# EAGLE design Eyebot_powerdist (EAGLE 6.4)
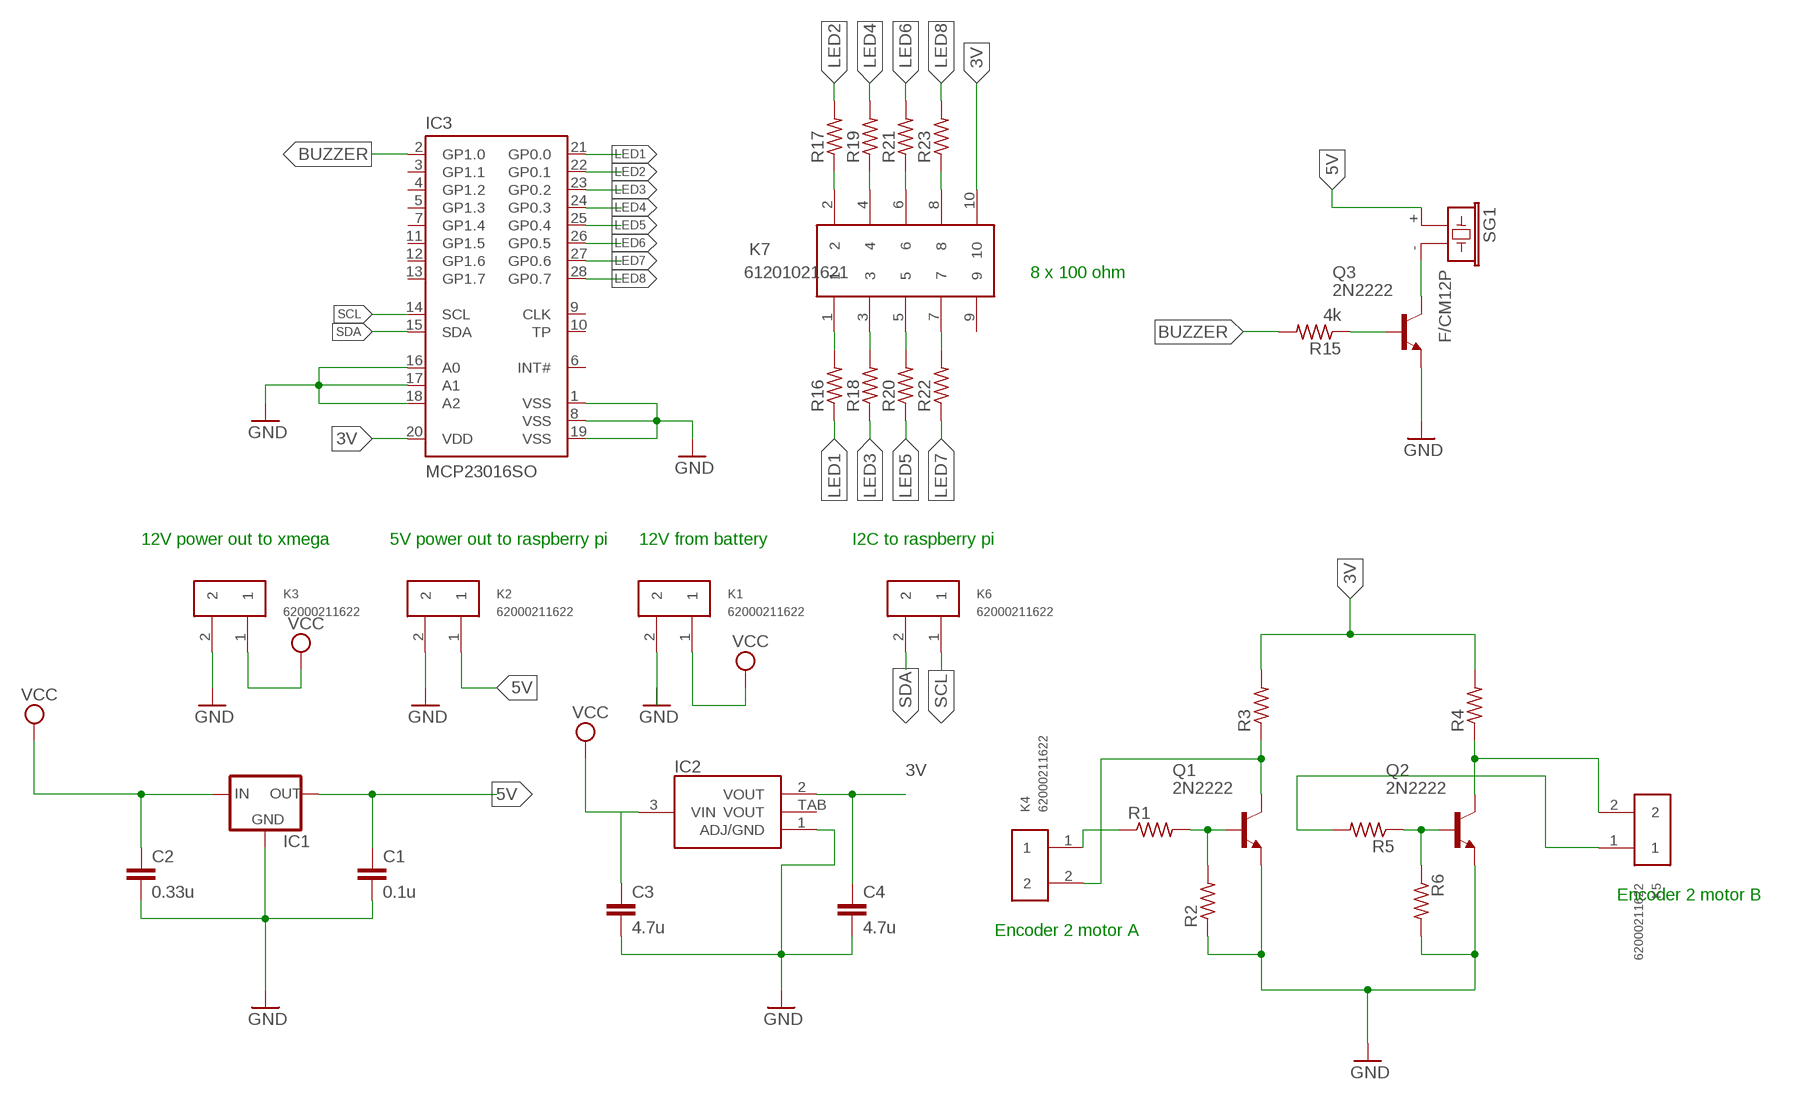
[diagram p0: schematic, sheet 1]

## Parts
C1  0.1u  CAP_  [AXIAL-5MM]
C2  0.33u  CAPPTH  [CAP-PTH-SMALL]
C3  4.7u  CAP1206  [1206]
C4  4.7u  CAP1206  [1206]
IC1  V_REG_78XX-TO-220  [TO-220-ALT]
IC2  LDO1117-SOT223  [SOT223-3L]
IC3  MCP23016SO  [SO-28W]
K1  62000211622  [62000211622]
K2  62000211622  [62000211622]
K3  62000211622  [62000211622]
K4  62000211622  [62000211622]
K5  62000211622  [62000211622]
K6  62000211622  [62000211622]
K7  61201021621  [61201021621]
Q1  2N2222  [TO18]
Q2  2N2222  [TO18]
Q3  2N2222  [TO18]
R1  R-US_0309/10  [0309/10]
R2  R-US_0309/10  [0309/10]
R3  R-US_0309/10  [0309/10]
R4  R-US_0309/10  [0309/10]
R5  R-US_0309/10  [0309/10]
R6  R-US_0309/10  [0309/10]
R15  4k  R-US_0309/10  [0309/10]
R16  R-US_0309/10  [0309/10]
R17  R-US_0309/10  [0309/10]
R18  R-US_0309/10  [0309/10]
R19  R-US_0309/10  [0309/10]
R20  R-US_0309/10  [0309/10]
R21  R-US_0309/10  [0309/10]
R22  R-US_0309/10  [0309/10]
R23  R-US_0309/10  [0309/10]
SG1  F/CM12P  [F/CM12P]

## Nets
3V: C4.1 IC2.2(VOUT) IC3.20(VDD) K7.10 R3.2 R4.2
5V: C1.P$1 IC1.OUT K2.1 SG1.+
BUZZER: IC3.2(GP1.0) R15.2
GND: C1.P$2 C2.2 C3.2 C4.2 IC1.GND IC2.1(ADJ/GND) IC3.1(VSS) IC3.8(VSS) IC3.16(A0) IC3.17(A1) IC3.18(A2) IC3.19(VSS) K1.2 K2.2 K3.2 Q1.1(E) Q2.1(E) Q3.1(E) R2.1 R6.2
LED1: IC3.21(GP0.0) R16.1
LED2: IC3.22(GP0.1) R17.2
LED3: IC3.23(GP0.2) R18.1
LED4: IC3.24(GP0.3) R19.2
LED5: IC3.25(GP0.4) R20.1
LED6: IC3.26(GP0.5) R21.2
LED7: IC3.27(GP0.6) R22.1
LED8: IC3.28(GP0.7) R23.2
N$1: Q1.2(B) R1.2 R2.2
N$2: K4.2 Q1.3(C) R3.1
N$3: K4.1 R1.1
N$4: K7.2 R17.1
N$5: Q2.2(B) R5.1 R6.1
N$6: K7.4 R19.1
N$7: K5.1 R5.2
N$8: K5.2 Q2.3(C) R4.1
N$9: K7.6 R21.1
N$10: K7.8 R23.1
N$12: K7.7 R22.2
N$13: K7.5 R20.2
N$14: K7.3 R18.2
N$16: K7.1 R16.2
N$25: Q3.2(B) R15.1
N$26: Q3.3(C) SG1.-
SCL: IC3.14(SCL) K6.1
SDA: IC3.15(SDA) K6.2
VCC: C2.1 C3.1 IC1.IN IC2.3(VIN) K1.1 K3.1
Unconnected: IC2.TAB(VOUT) IC3.3(GP1.1) IC3.4(GP1.2) IC3.5(GP1.3) IC3.6(INT#) IC3.7(GP1.4) IC3.9(CLK) IC3.10(TP) IC3.11(GP1.5) IC3.12(GP1.6) IC3.13(GP1.7) K7.9

## Notes on the sheet
- 8 x 100 ohm
- 12V power out to xmega | 5V power out to raspberry pi | 12V from battery | I2C to raspberry pi
- Encoder 2 motor B
- Encoder 2 motor A

## Library data of the parts
C1-C4 = SparkFun-Capacitors:CAP: Capacitor Standard 0603 ceramic capacitor, and 0.1" leaded capacitor.
IC1 = SparkFun-PowerIC:V_REG_78XX: Voltage Regulator Standard 7805 5V regulator. IGO (Input Ground Output). Spark Fun Electronics SKU : COM-00107
IC2 = dan-vreg:LDO1117: LDO1117 e.g. http://www.diodes.com/datasheets/ZLDO1117.pdf
IC3 = microchip2:MCP23016: 16-Bit I/O Expander with I2C Interface
K1-K6 = Wuerth_Elektronik_eiCan_09_Wire_to_Board_Connectors:62000211622: WR-WTB 2.00mm Male Vertical Shrouded Header, 2 Pins
K7 = Wuerth_Elektronik_eiCan_05_Box_Header_IDC_Connectors_1_2:61201021621: WR-BHD 2.54mm Male Box Header, 10 Pins
Q1-Q3 = transistor-npn:2N2222*: NPN Transistor
R1-R6 R15-R23 = resistor:R-US_: RESISTOR, American symbol
SG1 = buzzer:F/CM12P: BUZZER Source: Buerklin; OC_FARNELL: unknown; OC_NEWARK: unknown

## Board
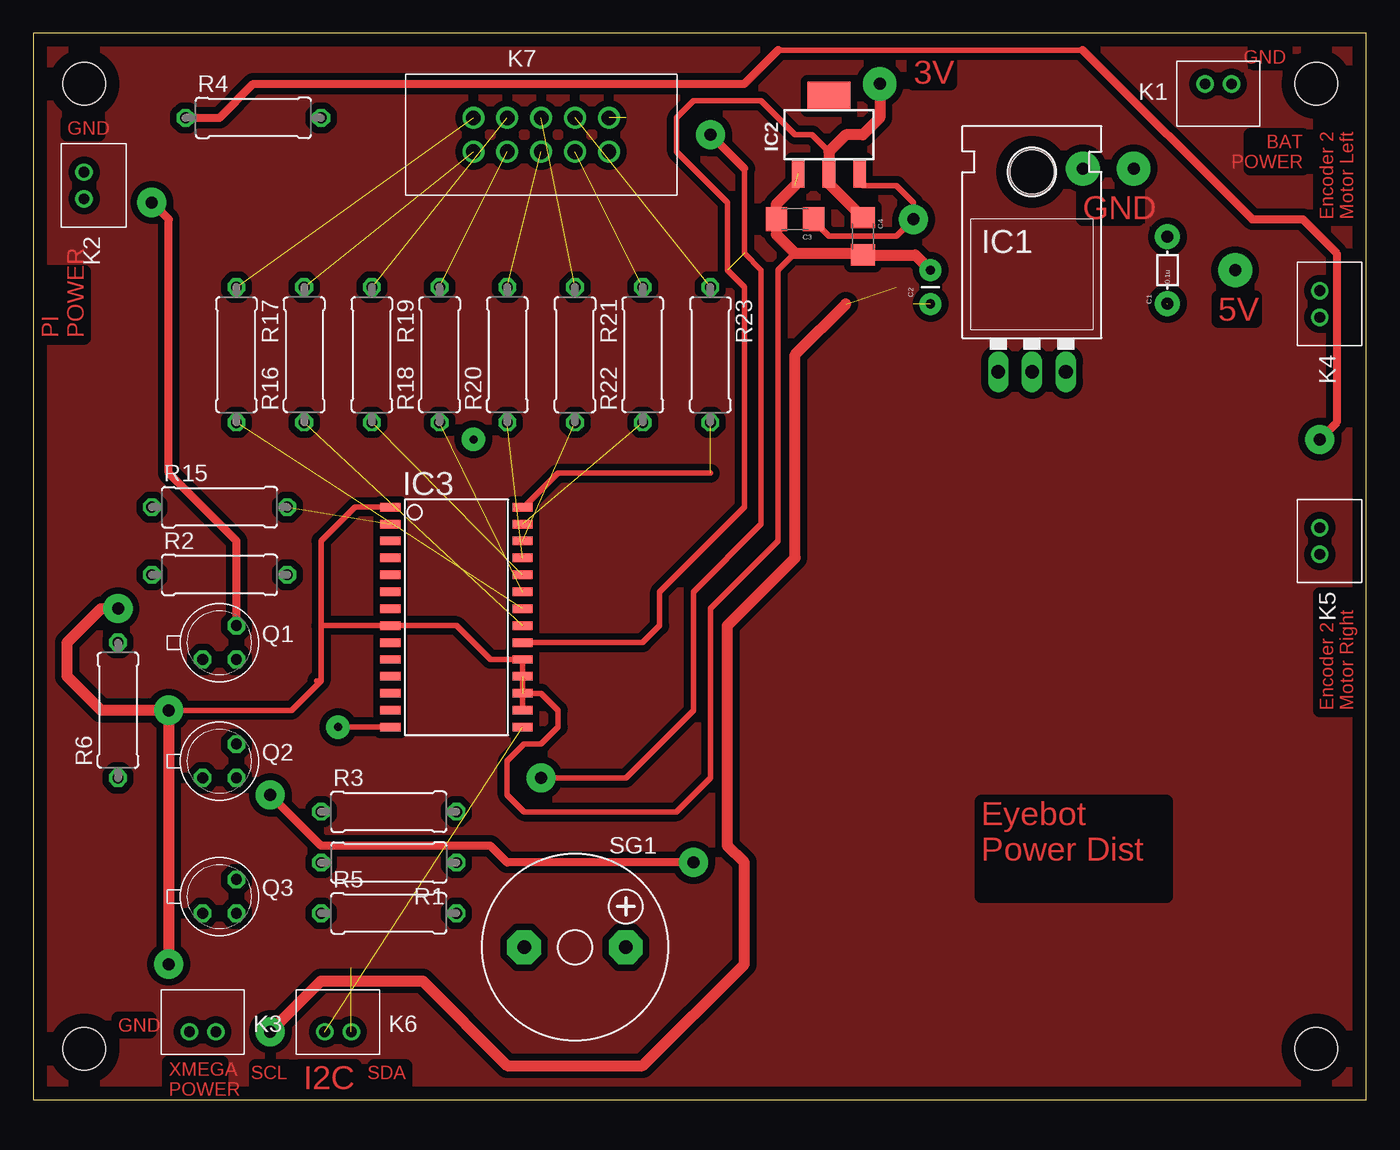
[diagram p1: board, top side]
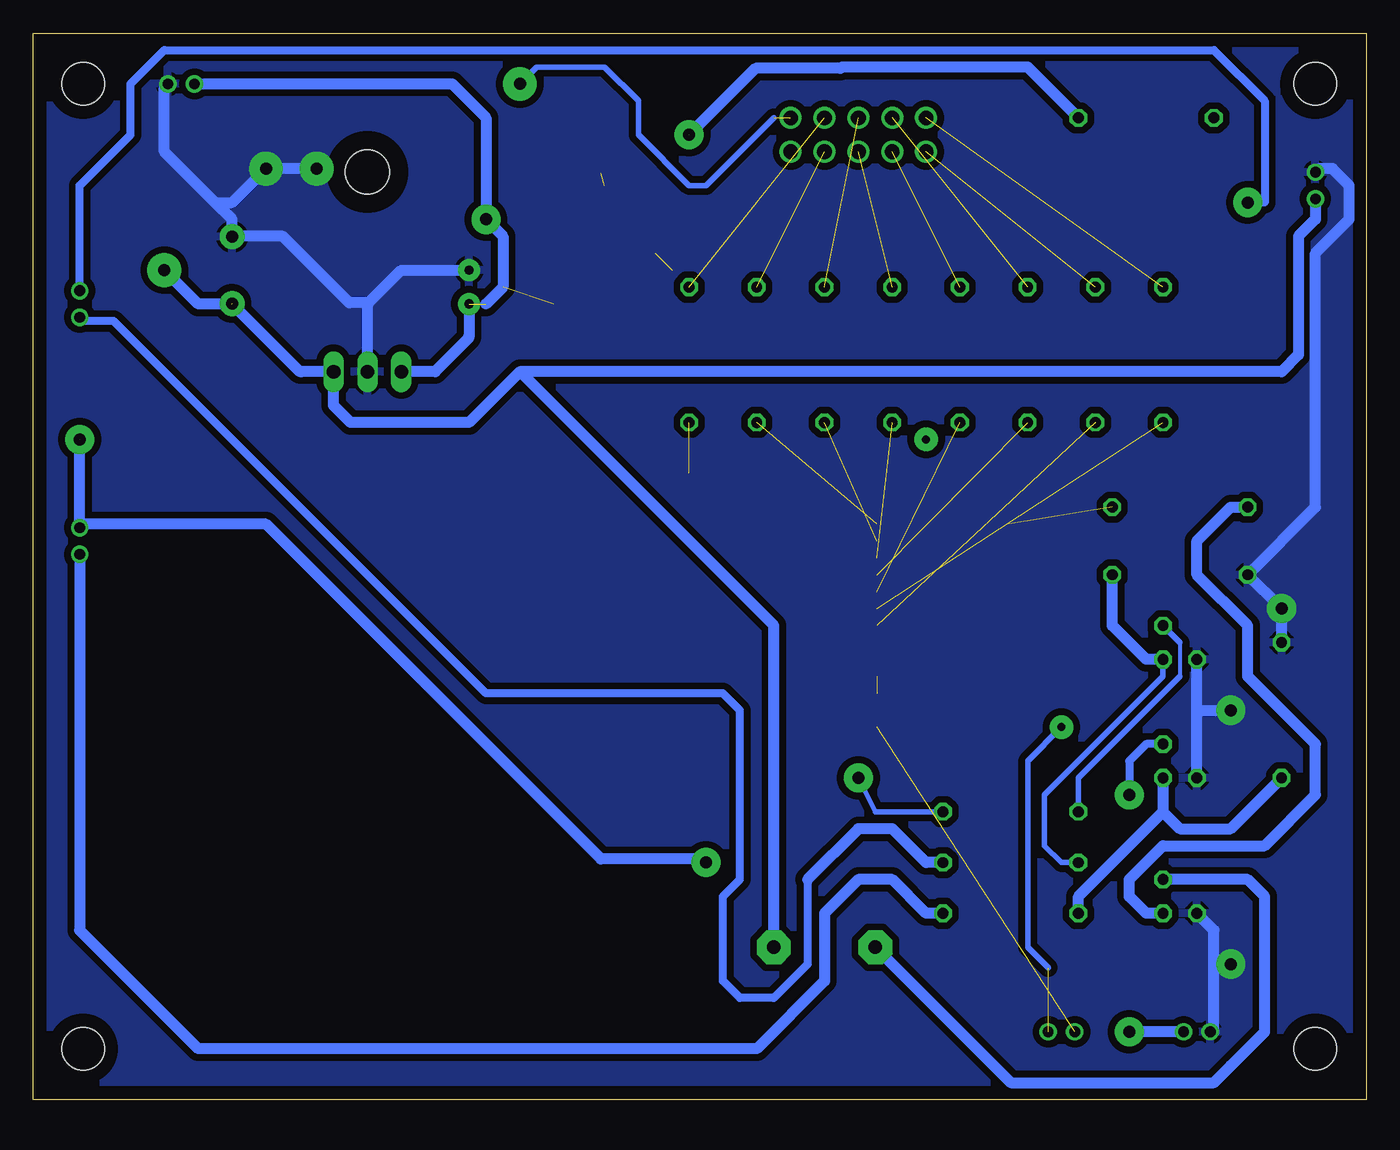
[diagram p2: board, bottom side, seen from below]

Size 100 x 80 mm. Coordinates in mm from the lower left corner, seen from the top.
Outline: 0,0 100,0 100,80 0,80 0,0
Copper layers (1*16): Top 0.035mm / dielectric 1.5mm / Bottom 0.035mm
Design rules "default *": minimum track width 10mil, minimum drill 24mil, track to track 20mil, track to pad 20mil, pad to pad 8mil, via to via 8mil, smd to smd 8mil, copper to edge 40mil, drill to drill 8mil, minimum pad ring 10mil, minimum via ring 8mil, stop-mask expansion 4mil, vias tented up to drill 0mil, thermal gap 10mil
Holes 3.2 mm at 3.81,76.2 96.27,76.2 96.27,3.81 3.81,3.81

### Footprints (pad centres in the part's own frame; a part is rotated, then mirrored left to right if it is on the bottom)
AXIAL-5MM = drill 0.9 pad 1.88: P$1 -2.5,0; P$2 2.5,0
CAP-PTH-SMALL = drill 0.7 pad 1.651: 1 0,0; 2 2.54,0
1206 = smd 1.6 x 1.8: 1 -1.4,0; 2 1.4,0
TO-220-ALT = drill 1.016 long: GND 0,-3.81; IN -2.54,-3.81; OUT 2.54,-3.81 | hole 3.302: 0,11.176
SOT223-3L = smd 0.95 x 2.15: 1 -2.3,-2.9; 2 0,-2.9; 3 2.3,-2.9 | smd 3.25 x 2.15: TAB 0,2.9
SO-28W = smd 0.635 x 1.524: 1 -7.62,-4.953; 2 -6.35,-4.953; 3 -5.08,-4.953; 4 -3.81,-4.953; 5 -2.54,-4.953; 6 -1.27,-4.953; 7 0,-4.953; 8 1.27,-4.953; 9 2.54,-4.953; 10 3.81,-4.953; 11 5.08,-4.953; 12 6.35,-4.953; 13 7.62,-4.953; 14 8.89,-4.953; 15 8.89,4.953; 16 7.62,4.953; 17 6.35,4.953; 18 5.08,4.953; 19 3.81,4.953; 20 2.54,4.953; 21 1.27,4.953; 22 0,4.953; 23 -1.27,4.953; 24 -2.54,4.953; 25 -3.81,4.953; 26 -5.08,4.953; 27 -6.35,4.953; 28 -7.62,4.953
62000211622 = drill 0.8: 1 1,0; 2 -1,0
61201021621 = drill 1.1: 1 -2.54,-1.27; 2 -2.54,1.27; 3 0,-1.27; 4 0,1.27; 5 2.54,-1.27; 6 2.54,1.27; 7 5.08,-1.27; 8 5.08,1.27; 9 7.62,-1.27; 10 7.62,1.27
TO18 = drill 0.813 octagon: 1 -1.27,-1.27; 2 1.27,-1.27; 3 1.27,1.27
0309/10 = drill 0.813 octagon: 1 -5.08,0; 2 5.08,0
F/CM12P = drill 1.016 pad 2.54 octagon: + 3.81,0; - -3.81,0

### Placement (x,y rotation side)
C1  85.09,62.23 90 top
C2  67.31,59.69 90 top
C3  57.15,66.04 180 top
C4  62.23,64.77 270 top
IC1  74.93,58.42 0 top
IC2  59.69,72.39 0 top
IC3  31.75,36.83 270 top
K1  88.9,76.2 180 top
K2  3.81,68.58 270 top
K3  12.7,5.08 0 top
K4  96.52,59.69 270 top
K5  96.52,41.91 270 top
K6  22.86,5.08 0 top
K7  35.56,72.39 0 top
Q1  13.97,34.29 0 top
Q2  13.97,25.4 0 top
Q3  13.97,15.24 0 top
R1  26.67,17.78 180 top
R2  13.97,39.37 0 top
R3  26.67,21.59 0 top
R4  16.51,73.66 0 top
R5  26.67,13.97 0 top
R6  6.35,29.21 90 top
R15  13.97,44.45 0 top
R16  20.32,55.88 90 top
R17  15.24,55.88 270 top
R18  30.48,55.88 90 top
R19  25.4,55.88 270 top
R20  35.56,55.88 90 top
R21  40.64,55.88 270 top
R22  45.72,55.88 90 top
R23  50.8,55.88 270 top
SG1  40.64,11.43 0 top

### Tracks (layer width: path | path; a pad name or v marks a point on that pad's centre or on a via)
3V  (via drill 0.9 pad 2.18, 0.9 pad 2.54)  (3 unrouted)
  Top 0.406: 59.69,71.12 58.42,72.39 57.15,72.39 54.61,74.93 49.53,74.93 48.26,73.66 48.26,71.12 52.07,67.31 52.07,62.23 53.34,60.96 53.34,44.45 46.99,38.1 46.99,35.56 45.72,34.29 IC3.20 | 59.69,69.85 IC2.2 | 53.34,69.85 53.34,63.5 54.61,62.23 54.61,43.18 49.53,38.1 49.53,29.21 44.45,24.13 v38.1,24.13
  Top 0.61: 53.34,69.85 50.8,72.39
  Top 0.813: IC2.2 59.69,68.71 C4.1 | v63.5,76.2 63.5,73.66 62.23,72.39 60.96,72.39 59.69,71.12 59.69,69.85
  Bottom 0.406: 44.45,73.66 49.53,68.58 50.8,68.58 54.61,72.39 54.61,74.93 57.15,77.47 62.23,77.47 v63.5,76.2 | R3.2 36.83,21.59 v38.1,24.13
  Bottom 0.813: R4.2 25.4,77.47 39.24,77.47 arc-45 39.46,77.38 45.81,77.38 50.8,72.39
5V  (via drill 0.9 pad 2.54)  (1 unrouted)
  Bottom 0.813: K2.1 3.81,66.04 5.08,64.77 5.08,55.88 6.35,54.61 63.5,54.61 | 63.5,54.61 67.31,50.8 76.2,50.8 77.47,52.07 IC1.OUT 79.88,54.61 arc45 80.1,54.7 85.09,59.69 87.63,59.69 v90.17,62.23 | SG1.+ 44.45,35.56 63.5,54.61
BUZZER  (1 unrouted)
GND  (via drill 0.9 pad 2.18, 0.9 pad 2.54)  (2 unrouted)
  Top 0.406: 21.59,31.42 21.26,31.42 | v10.16,29.21 19.38,29.21 21.59,31.42 | 21.59,35.56 21.59,31.42 | 57.15,63.5 55.88,62.23 55.88,41.91 50.8,36.83 50.8,24.13 48.26,21.59 36.83,21.59 35.56,22.86 35.56,25.4 36.83,26.67 38.1,26.67 39.37,27.94 39.37,29.21 38.1,30.48 IC3.17 | IC3.17 IC3.19 34.29,33.02 31.75,35.56 IC3.8 21.59,35.56 | IC3.17 IC3.16 | IC3.1 24.13,44.45 21.59,41.91 21.59,35.56
  Top 0.813: 57.15,68.58 55.75,67.18 C3.2 55.75,64.9 57.15,63.5 62.1,63.5 C4.2 66.17,63.37 C2.2 | v10.16,10.16 v10.16,29.21 5.08,29.21 2.54,31.75 2.54,34.29 5.08,36.83 v6.35,36.83
  Bottom 0.813: IC1.GND 74.93,59.56 arc45 74.84,59.78 | 74.84,59.78 72.39,62.23 C2.2 | R6.2 v6.35,36.83 R2.1 3.81,44.45 3.81,63.5 1.27,66.04 1.27,68.58 2.54,69.85 3.54,69.85 K2.2 | 11.43,5.08 11.43,10.16 | 11.43,10.16 11.43,12.7 Q3.1 | Q2.1 12.7,29.21 | 12.7,29.21 Q1.1 | 86.36,67.31 85.09,66.04 C1.P$2 85.05,64.77 81.28,64.77 76.29,59.78 74.84,59.78 | 86.36,67.31 90.17,71.12 90.17,75.93 K1.2 | 12.7,29.21 v10.16,29.21 | 11.43,10.16 v10.16,10.16 | 86.36,67.31 85.09,67.31 v82.55,69.85 v78.74,69.85
  pour Bottom: 0,80.01 100.33,80.01 100.33,0 0,0
LED1  (1 unrouted)
LED2  (1 unrouted)
LED3  (1 unrouted)
LED4  (1 unrouted)
LED5  (1 unrouted)
LED6  (1 unrouted)
LED7  (1 unrouted)
LED8  (1 unrouted)
  Top 0.406: IC3.28 36.83,44.45 39.37,46.99 50.8,46.99
N$1
  Bottom 0.406: R1.2 22.86,17.78 24.13,19.05 24.13,22.86 15.24,31.75 Q1.2
  Bottom 0.813: Q1.2 16.51,33.02 19.05,35.56 R2.2
N$2  (via drill 0.9 pad 2.18)
  Top 0.61: Q1.3 15.24,41.91 10.16,46.99 10.16,66.04 v8.89,67.31
  Bottom 0.305: 13.97,34.29 13.97,31.75
  Bottom 0.406: Q1.3 13.97,34.29 | 13.97,31.75 21.59,24.13 R3.1
  Bottom 0.61: K4.2 96.52,68.58 92.71,72.39 92.71,76.2 90.17,78.74 11.43,78.74 7.62,74.93 7.62,67.31 v8.89,67.31
N$3
  Bottom 0.61: 41.91,16.51 41.91,10.16 44.45,7.62 46.99,7.62 48.26,8.89 48.26,15.24 46.99,16.51 46.99,29.21 48.26,30.48 66.04,30.48 93.98,58.42 96.25,58.42 K4.1
  Bottom 0.813: R1.1 33.02,17.78 35.56,20.32 38.1,20.32 41.91,16.51
N$4  (1 unrouted)
N$5
  Bottom 0.813: Q2.2 15.24,21.59 | 15.24,21.59 13.97,20.32 10.16,20.32 R6.1 | R5.1 21.59,15.24 15.24,21.59
N$6  (1 unrouted)
N$7
  Bottom 0.813: R5.2 33.02,13.97 35.56,16.51 38.1,16.51 40.64,13.97 40.64,8.89 45.72,3.81 87.63,3.81 96.52,12.7 K5.1
N$8  (via drill 0.9 pad 2.18)  (1 unrouted)
  Top 0.406: 55.88,78.74 78.74,78.74
  Top 0.61: v49.53,17.78 35.56,17.78 34.29,19.05 21.59,19.05 v17.78,22.86 | R4.1 13.97,73.66 16.51,76.2 53.34,76.2 55.88,78.74 | 78.74,78.74 91.44,66.04 95.25,66.04 97.79,63.5 97.79,50.8 96.52,49.53
  Bottom 0.61: Q2.3 16.51,26.67 17.78,25.4 v17.78,22.86 | 49.8,18.05 v49.53,17.78
  Bottom 0.813: 49.8,18.05 57.42,18.05 82.55,43.18 96.25,43.18 K5.2 96.52,49.53
N$9  (1 unrouted)
N$10  (1 unrouted)
N$12  (1 unrouted)
N$13  (1 unrouted)
N$14  (1 unrouted)
N$15  (via drill 0.6 pad 1.78)
  other vias: 33.02,49.53
N$16  (1 unrouted)
N$25
  Bottom 0.813: Q3.2 16.51,13.97 17.78,15.24 17.78,16.51 15.24,19.05 7.62,19.05 3.81,22.86 3.81,26.67 8.89,31.75 8.89,35.56 12.7,39.37 12.7,41.91 10.16,44.45 R15.1
N$26
  Bottom 0.813: SG1.- 26.67,1.27 11.43,1.27 10.16,2.54 7.62,5.08 7.62,15.24 8.89,16.51 Q3.3
N$30  (via drill 0.9 pad 2.18)
  other vias: 96.52,49.53
N$31  (via drill 0.9 pad 2.18)
  other vias: 50.8,72.39
N$33
  pour Top: 0,80.01 100.33,80.01 100.33,0 0,0
SCL  (via drill 0.6 pad 1.78)  (1 unrouted)
  Top 0.406: IC3.14 v22.86,27.94
  Bottom 0.406: 23.86,9.89 25.4,11.43 25.4,25.4 v22.86,27.94
SDA  (1 unrouted)
VCC  (via drill 0.9 pad 2.18)  (2 unrouted)
  Top 0.406: C3.1 58.55,65.91 59.69,64.77 64.77,64.77 v66.04,66.04 66.04,67.31 64.77,68.58 62.23,68.58 62.23,69.25 IC2.3
  Top 0.813: v17.78,5.08 21.59,8.89 29.21,8.89 35.56,2.54 45.72,2.54 53.34,10.16 53.34,17.78 52.07,19.05 52.07,35.56 57.15,40.64 57.15,55.88 60.96,59.69
  Bottom 0.813: K1.1 68.58,76.2 66.04,73.66 v66.04,66.04 64.77,64.77 64.77,60.96 66.04,59.69 | K3.1 v17.78,5.08 | C2.1 67.31,57.28 arc45 67.4,57.06 69.85,54.61 IC1.IN

### Text on the board
Top: GND | 3V | GND | BAT / POWER | GND | Encoder 2 / Motor Left | 5V | PI / POWER | Encoder 2 / Motor Right | Eyebot / Power Dist | GND | SCL | I2C | SDA | XMEGA / POWER